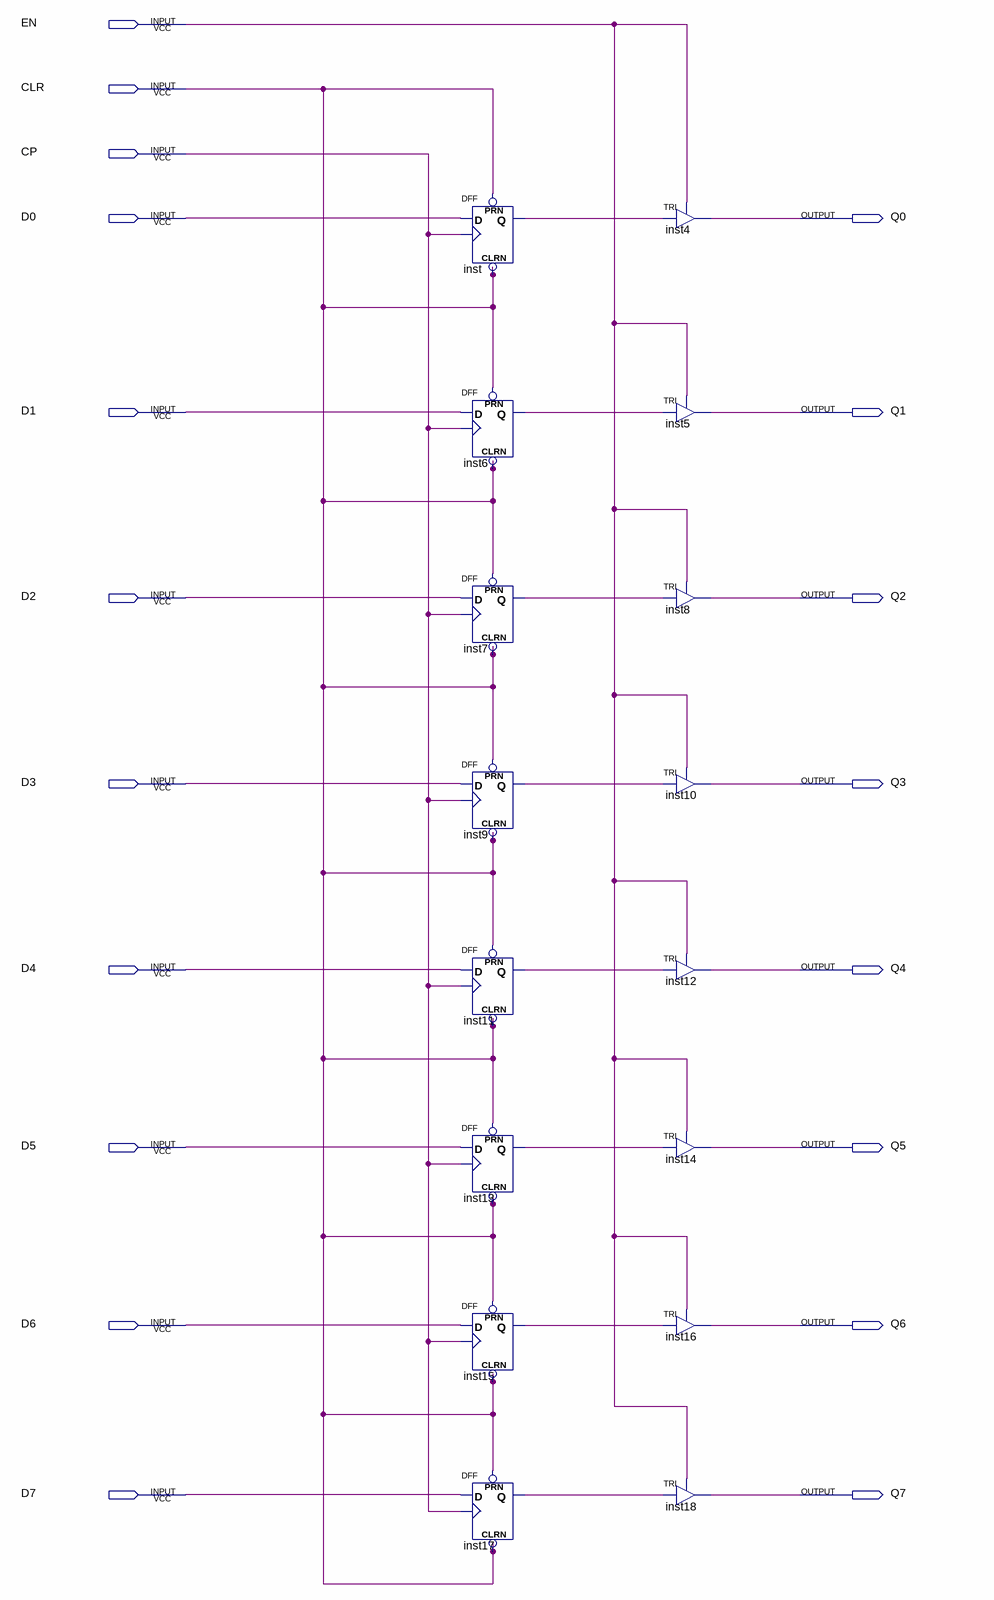
[diagram p0: schematic sheet]
// Quartus schematic R_8E.bdf as structural Verilog: 16 symbols, 19 pins
module R_8E (
  input  EN,
  input  CLR,
  input  CP,
  input  D0,
  input  D1,
  input  D2,
  input  D3,
  input  D4,
  input  D5,
  input  D6,
  input  D7,
  output Q0,
  output Q1,
  output Q2,
  output Q3,
  output Q4,
  output Q5,
  output Q6,
  output Q7
);

  wire inst6_q, inst7_q, inst9_q, inst11_q, inst13_q, inst15_q, inst17_q, inst_q;

  DFF inst (.CLRN(CLR), .CLK(CP), .D(D0), .PRN(CLR), .Q(inst_q));
  DFF inst6 (.CLRN(CLR), .CLK(CP), .D(D1), .PRN(CLR), .Q(inst6_q));
  DFF inst7 (.CLRN(CLR), .CLK(CP), .D(D2), .PRN(CLR), .Q(inst7_q));
  DFF inst9 (.CLRN(CLR), .CLK(CP), .D(D3), .PRN(CLR), .Q(inst9_q));
  DFF inst11 (.CLRN(CLR), .CLK(CP), .D(D4), .PRN(CLR), .Q(inst11_q));
  DFF inst13 (.CLRN(CLR), .CLK(CP), .D(D5), .PRN(CLR), .Q(inst13_q));
  DFF inst15 (.CLRN(CLR), .CLK(CP), .D(D6), .PRN(CLR), .Q(inst15_q));
  DFF inst17 (.CLRN(CLR), .CLK(CP), .D(D7), .PRN(CLR), .Q(inst17_q));
  TRI inst4 (.IN(inst_q), .OE(EN), .OUT(Q0));
  TRI inst5 (.IN(inst6_q), .OE(EN), .OUT(Q1));
  TRI inst8 (.IN(inst7_q), .OE(EN), .OUT(Q2));
  TRI inst10 (.IN(inst9_q), .OE(EN), .OUT(Q3));
  TRI inst12 (.IN(inst11_q), .OE(EN), .OUT(Q4));
  TRI inst14 (.IN(inst13_q), .OE(EN), .OUT(Q5));
  TRI inst16 (.IN(inst15_q), .OE(EN), .OUT(Q6));
  TRI inst18 (.IN(inst17_q), .OE(EN), .OUT(Q7));
endmodule
